# Altium project DIO_MCX_Isolated.PrjPCB (part 1 of 3)
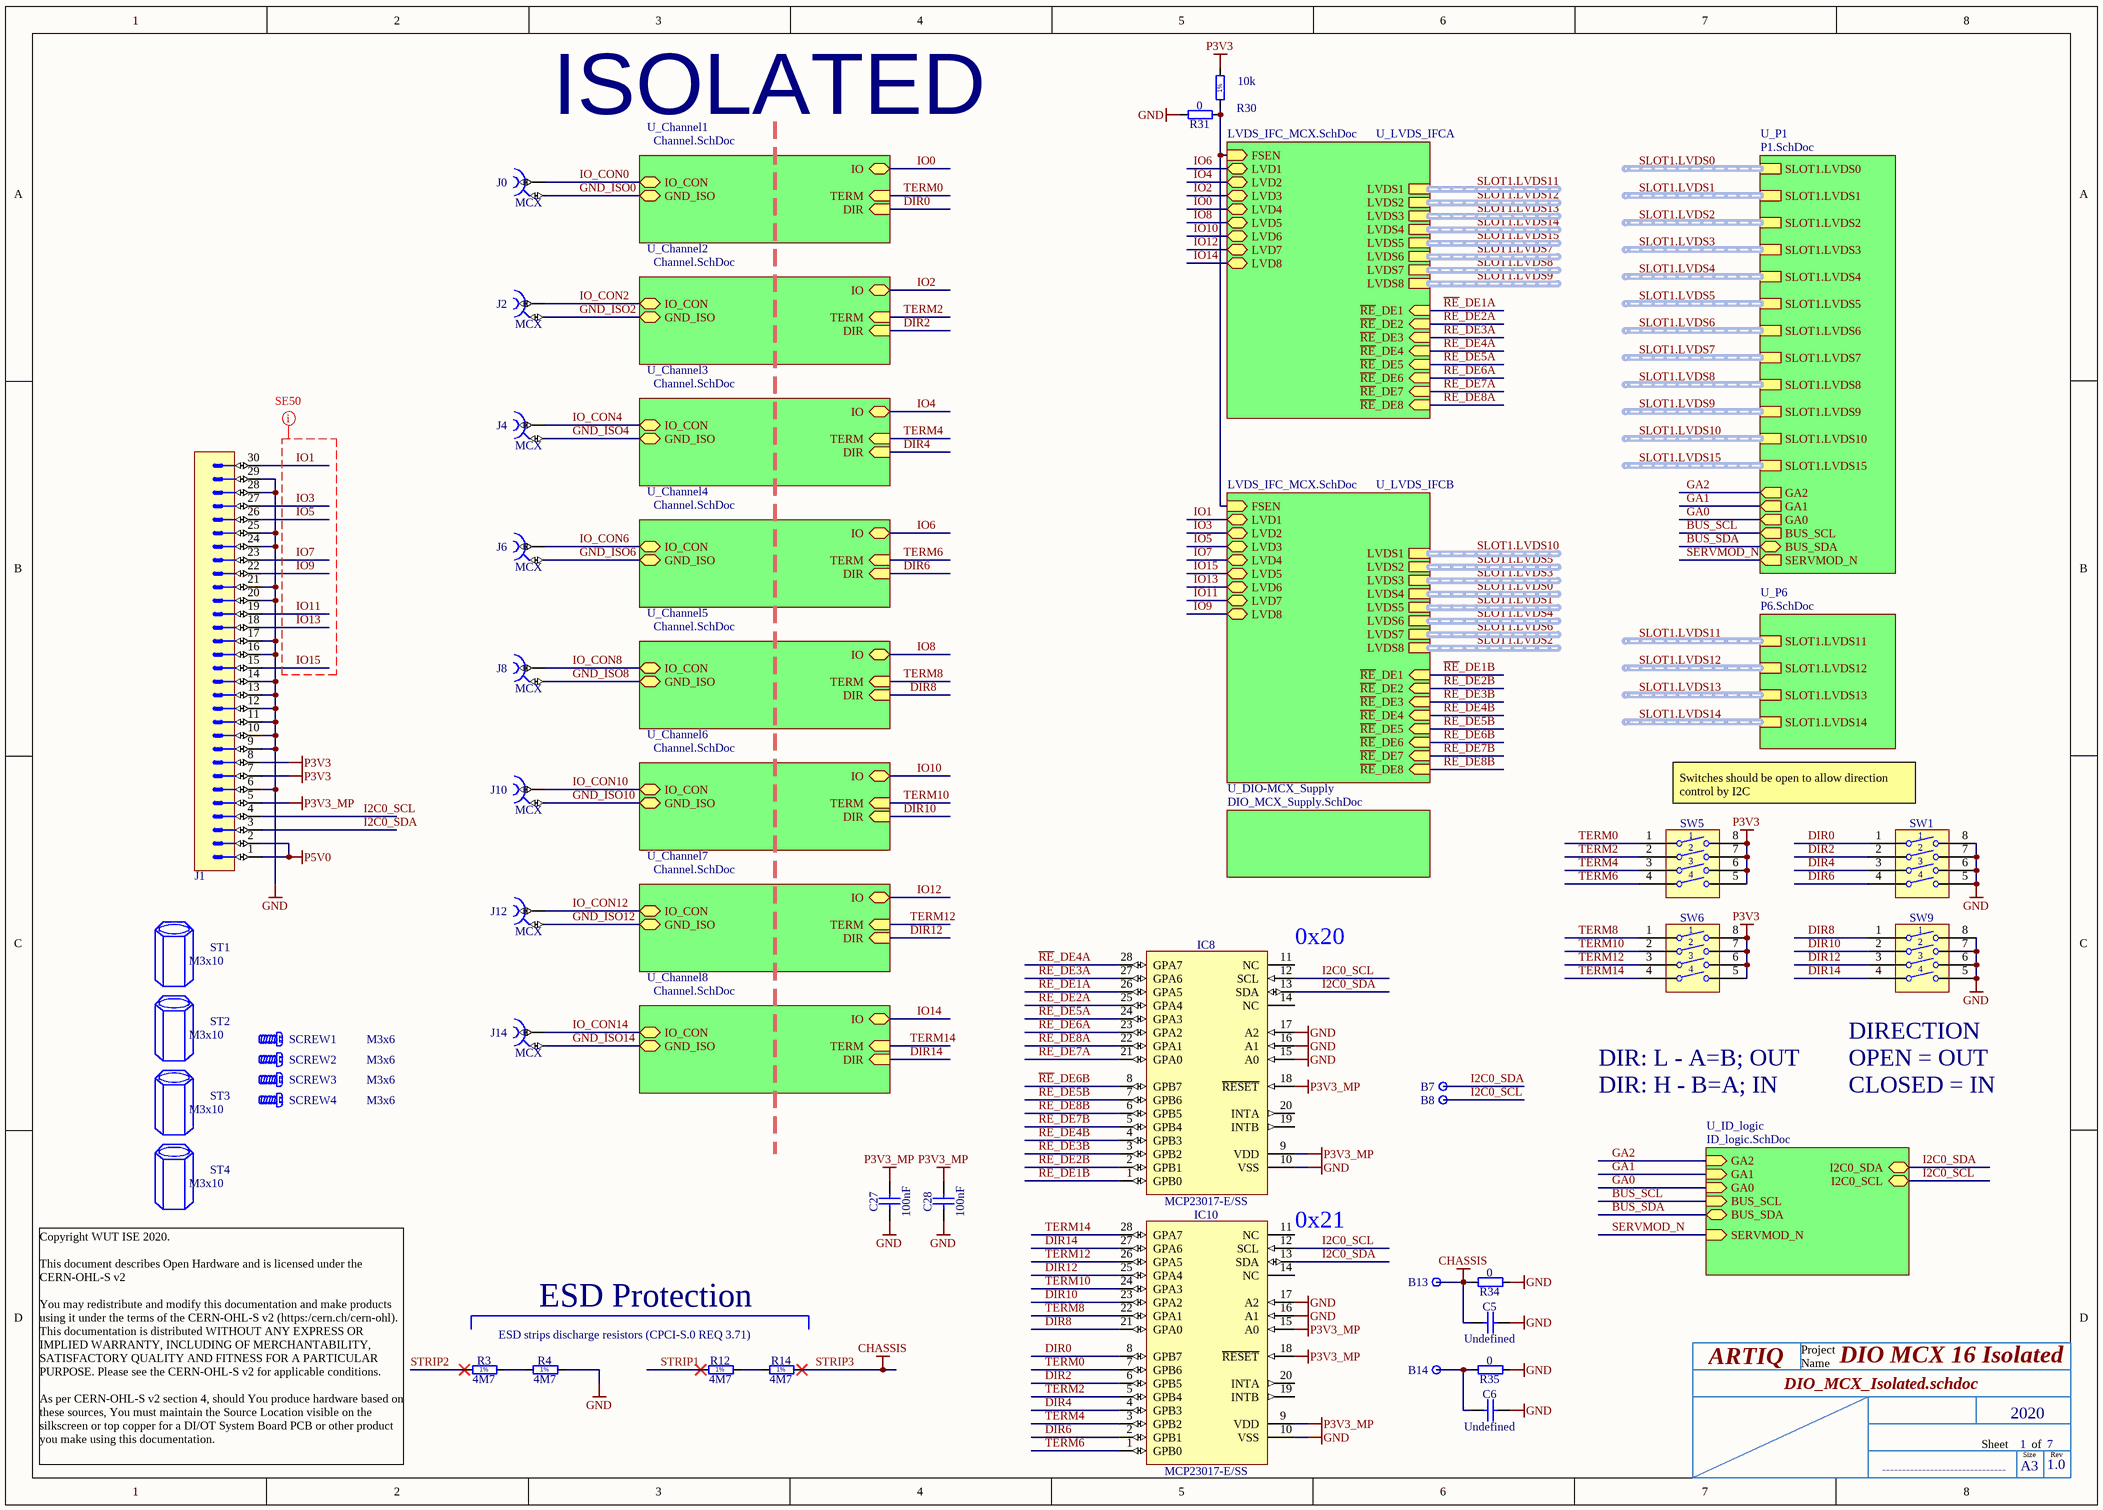
[diagram p0: DIO_MCX_Isolated.schdoc]
7 sheets, 384 parts. Net scope: hierarchical (ports join the sheet entries above them; power ports are global).
Board file: DIO_MCX_Isolated.PCBDOC
Sheets:
  DIO_MCX_Isolated.schdoc
    U_DIO-MCX_Supply = DIO_MCX_Supply.SchDoc
    U_LVDS_IFCA = LVDS_IFC_MCX.SchDoc
    U_LVDS_IFCB = LVDS_IFC_MCX.SchDoc
    U_ID_logic = ID_logic.SchDoc
    U_P1 = P1.SchDoc
    U_P6 = P6.SchDoc
    U_Channel1 = Channel.SchDoc
    U_Channel2 = Channel.SchDoc
    U_Channel3 = Channel.SchDoc
    U_Channel4 = Channel.SchDoc
    U_Channel5 = Channel.SchDoc
    U_Channel6 = Channel.SchDoc
    U_Channel7 = Channel.SchDoc
    U_Channel8 = Channel.SchDoc

## Sheet DIO_MCX_Isolated.schdoc: DIO MCX 16 Isolated
size A3; EDA_Number: ARTIQ; Projet: ARTIQ/SINARA Kasli Subsystem; Author: F.Świtakowski; CompanyName: WUT ISE; DrawnBy: F.Świtakowski; Organization: WUT ISE; Address1: PW ISE; Address2: Nowowiejska 15/19 00-665 Warsaw; DocumentNumber: 1; Revision: 2; SheetNumber: 1; SheetTotal: 7; ModifiedBy: -; CheckedDate: -; Title2: Baseboard Top; DivGrp: WUT ISE; Designer: F.Świtakowski; ModifiedDate: -; ProjectName: Sensor Box

### Parts
B7  Plated Hole  [c130h60]  (value not drawn)
B8  Plated Hole  [c130h60]  (value not drawn)
B13  Plated Hole  [MTG270_500]  (value not drawn)
B14  Plated Hole  [MTG270_500]  (value not drawn)
C5  Undefined  [CAPC2012X135N]
C6  Undefined  [CAPC2012X135N]
C27  100nF  [CAPC1005X55N]
C28  100nF  [CAPC1005X55N]
IC8  MCP23017-E/SS  [SOP65P780X200-28N]
IC10  MCP23017-E/SS  [SOP65P780X200-28N]
J0  MCX  [BEL_133-3701-801]
J1  (no value)  [3M_N2530-6002RB]
J2  MCX  [BEL_133-3701-801]
J4  MCX  [BEL_133-3701-801]
J6  MCX  [BEL_133-3701-801]
J8  MCX  [BEL_133-3701-801]
J10  MCX  [BEL_133-3701-801]
J12  MCX  [BEL_133-3701-801]
J14  MCX  [BEL_133-3701-801]
R3  4M7  [RESC2113X55N]
R4  4M7  [RESC2113X55N]
R12  4M7  [RESC2113X55N]
R14  4M7  [RESC2113X55N]
R30  10k  [RESC1005X40N]
R31  0  [RESC1608X55N]
R34  0  [RESC1608X55N]
R35  0  [RESC1608X55N]
SCREW1  M3x6  [BOSSARD_BN5687-3061605_v]
SCREW2  M3x6  [BOSSARD_BN5687-3061605_v]
SCREW3  M3x6  [BOSSARD_BN5687-3061605_v]
SCREW4  M3x6  [BOSSARD_BN5687-3061605_v]
ST1  M3x10  [HARWIN_R25-1001002]
ST2  M3x10  [HARWIN_R25-1001002]
ST3  M3x10  [HARWIN_R25-1001002]
ST4  M3x10  [HARWIN_R25-1001002]
SW1  Switch  [SW_OMRON_A6S-4102-H]  (value not drawn)
SW5  Switch  [SW_OMRON_A6S-4102-H]  (value not drawn)
SW6  Switch  [SW_OMRON_A6S-4102-H]  (value not drawn)
SW9  Switch  [SW_OMRON_A6S-4102-H]  (value not drawn)

### Sub-sheets
U_Channel1 = Channel.SchDoc: IO (bidir), TERM (in), DIR (in), IO_CON (bidir), GND_ISO (bidir)
U_Channel2 = Channel.SchDoc: IO (bidir), TERM (in), DIR (in), IO_CON (bidir), GND_ISO (bidir)
U_Channel3 = Channel.SchDoc: IO (bidir), TERM (in), DIR (in), IO_CON (bidir), GND_ISO (bidir)
U_Channel4 = Channel.SchDoc: IO (bidir), TERM (in), DIR (in), IO_CON (bidir), GND_ISO (bidir)
U_Channel5 = Channel.SchDoc: IO (bidir), TERM (in), DIR (in), IO_CON (bidir), GND_ISO (bidir)
U_Channel6 = Channel.SchDoc: IO (bidir), TERM (in), DIR (in), IO_CON (bidir), GND_ISO (bidir)
U_Channel7 = Channel.SchDoc: IO (bidir), TERM (in), DIR (in), IO_CON (bidir), GND_ISO (bidir)
U_Channel8 = Channel.SchDoc: IO (bidir), TERM (in), DIR (in), IO_CON (bidir), GND_ISO (bidir)
U_DIO-MCX_Supply = DIO_MCX_Supply.SchDoc: no entries
U_ID_logic = ID_logic.SchDoc: GA2 (in), GA1 (in), GA0 (in), BUS_SCL (in), BUS_SDA (bidir), SERVMOD_N (in), I2C0_SDA (bidir), I2C0_SCL (bidir)
U_LVDS_IFCA = LVDS_IFC_MCX.SchDoc: ~{RE}_DE1 (in), ~{RE}_DE2 (in), ~{RE}_DE3 (in), ~{RE}_DE4 (in), ~{RE}_DE5 (in), ~{RE}_DE6 (in), ~{RE}_DE7 (in), LVD1 (bidir), LVD2 (bidir), LVD5 (bidir), LVD6 (bidir), LVD7 (bidir), LVD3 (bidir), LVD4 (bidir), FSEN (in), LVDS1 (harness LVDS), ~{RE}_DE8 (in), LVDS2 (harness LVDS), LVDS3 (harness LVDS), LVDS4 (harness LVDS), LVDS5 (harness LVDS), LVDS6 (harness LVDS), LVDS7 (harness LVDS), LVDS8 (harness LVDS), LVD8 (bidir)
U_LVDS_IFCB = LVDS_IFC_MCX.SchDoc: LVD1 (bidir), LVD2 (bidir), LVD5 (bidir), LVD6 (bidir), LVD7 (bidir), LVD3 (bidir), LVD4 (bidir), ~{RE}_DE1 (in), ~{RE}_DE2 (in), ~{RE}_DE3 (in), ~{RE}_DE4 (in), ~{RE}_DE5 (in), ~{RE}_DE6 (in), ~{RE}_DE7 (in), FSEN (in), LVDS6 (harness LVDS), LVDS5 (harness LVDS), LVDS4 (harness LVDS), LVDS3 (harness LVDS), LVDS2 (harness LVDS), LVDS1 (harness LVDS), ~{RE}_DE8 (in), LVD8 (bidir), LVDS7 (harness LVDS), LVDS8 (harness LVDS)
U_P1 = P1.SchDoc: SLOT1.LVDS0 (harness LVDS), SLOT1.LVDS1 (harness LVDS), SLOT1.LVDS2 (harness LVDS), SLOT1.LVDS3 (harness LVDS), SLOT1.LVDS4 (harness LVDS), SLOT1.LVDS5 (harness LVDS), SLOT1.LVDS6 (harness LVDS), SLOT1.LVDS7 (harness LVDS), SLOT1.LVDS8 (harness LVDS), SLOT1.LVDS9 (harness LVDS), SLOT1.LVDS10 (harness LVDS), SLOT1.LVDS15 (harness LVDS), GA2 (out), GA1 (out), GA0 (out), BUS_SCL (out), BUS_SDA (bidir), SERVMOD_N (out)
U_P6 = P6.SchDoc: SLOT1.LVDS11 (harness LVDS), SLOT1.LVDS12 (harness LVDS), SLOT1.LVDS13 (harness LVDS), SLOT1.LVDS14 (harness LVDS)

### Nets
GND: C5.2 C6.2 C27.1 C28.1 IC8.10(VSS) IC8.15(A0) IC8.16(A1) IC8.17(A2) IC10.10(VSS) IC10.16(A1) IC10.17(A2) J1.6 J1.9 J1.10 J1.11 J1.12 J1.13 J1.14 J1.16 J1.17 J1.20 J1.21 J1.24 J1.25 J1.28 J1.29 R4.2 R31.2 R34.1 R35.1 SW1.5 SW1.6 SW1.7 SW1.8 SW9.5 SW9.6 SW9.7 SW9.8
P3V3: J1.7 J1.8 R30.2 SW5.5 SW5.6 SW5.7 SW5.8 SW6.5 SW6.6 SW6.7 SW6.8
P3V3_MP: C27.2 C28.2 IC8.9(VDD) IC8.18(~{RESET}) IC10.9(VDD) IC10.15(A0) IC10.18(~{RESET}) J1.5
P5V0: J1.1 J1.2
STRIP3: B13.1 C5.1 R14.2 R34.2  [also labelled CHASSIS]
BUS_SCL: sheet U_ID_logic/BUS_SCL, sheet U_P1/BUS_SCL
BUS_SDA: sheet U_ID_logic/BUS_SDA, sheet U_P1/BUS_SDA
DIR0: IC10.8(GPB7) SW1.1 ; sheet U_Channel1/DIR  [project net DIR]
DIR2: IC10.6(GPB5) SW1.2 ; sheet U_Channel2/DIR  [project net DIR]
DIR4: IC10.4(GPB3) SW1.3 ; sheet U_Channel3/DIR  [project net DIR]
DIR6: IC10.2(GPB1) SW1.4 ; sheet U_Channel4/DIR  [project net DIR]
DIR8: IC10.21(GPA0) SW9.1 ; sheet U_Channel5/DIR  [project net DIR]
DIR10: IC10.23(GPA2) SW9.2 ; sheet U_Channel6/DIR  [project net DIR]
DIR12: IC10.25(GPA4) SW9.3 ; sheet U_Channel7/DIR  [project net DIR]
DIR14: IC10.27(GPA6) SW9.4 ; sheet U_Channel8/DIR  [project net DIR]
GA0: sheet U_ID_logic/GA0, sheet U_P1/GA0
GA1: sheet U_ID_logic/GA1, sheet U_P1/GA1
GA2: sheet U_ID_logic/GA2, sheet U_P1/GA2
GND_ISO0: J0.2 ; sheet U_Channel1/GND_ISO  [project net GND_ISO]
GND_ISO2: J2.2 ; sheet U_Channel2/GND_ISO  [project net GND_ISO]
GND_ISO4: J4.2 ; sheet U_Channel3/GND_ISO  [project net GND_ISO]
GND_ISO6: J6.2 ; sheet U_Channel4/GND_ISO  [project net GND_ISO]
GND_ISO8: J8.2 ; sheet U_Channel5/GND_ISO  [project net GND_ISO]
GND_ISO10: J10.2 ; sheet U_Channel6/GND_ISO  [project net GND_ISO]
GND_ISO12: J12.2 ; sheet U_Channel7/GND_ISO  [project net GND_ISO]
GND_ISO14: J14.2 ; sheet U_Channel8/GND_ISO  [project net GND_ISO]
I2C0_SCL: B8.1 IC8.12(SCL) IC10.12(SCL) J1.4 ; sheet U_ID_logic/I2C0_SCL
I2C0_SDA: B7.1 IC8.13(SDA) IC10.13(SDA) J1.3 ; sheet U_ID_logic/I2C0_SDA
IO0: sheet U_LVDS_IFCA/LVD4, sheet U_Channel1/IO  [project net IO]
IO1: J1.30 ; sheet U_LVDS_IFCB/LVD1
IO2: sheet U_LVDS_IFCA/LVD3, sheet U_Channel2/IO  [project net IO]
IO3: J1.27 ; sheet U_LVDS_IFCB/LVD2
IO4: sheet U_LVDS_IFCA/LVD2, sheet U_Channel3/IO  [project net IO]
IO5: J1.26 ; sheet U_LVDS_IFCB/LVD3
IO6: sheet U_LVDS_IFCA/LVD1, sheet U_Channel4/IO  [project net IO]
IO7: J1.23 ; sheet U_LVDS_IFCB/LVD4
IO8: sheet U_LVDS_IFCA/LVD5, sheet U_Channel5/IO  [project net IO]
IO9: J1.22 ; sheet U_LVDS_IFCB/LVD8
IO10: sheet U_LVDS_IFCA/LVD6, sheet U_Channel6/IO  [project net IO]
IO11: J1.19 ; sheet U_LVDS_IFCB/LVD7
IO12: sheet U_LVDS_IFCA/LVD7, sheet U_Channel7/IO  [project net IO]
IO13: J1.18 ; sheet U_LVDS_IFCB/LVD6
IO14: sheet U_LVDS_IFCA/LVD8, sheet U_Channel8/IO  [project net IO]
IO15: J1.15 ; sheet U_LVDS_IFCB/LVD5
IO_CON0: J0.1 ; sheet U_Channel1/IO_CON  [project net IO_CON]
IO_CON2: J2.1 ; sheet U_Channel2/IO_CON  [project net IO_CON]
IO_CON4: J4.1 ; sheet U_Channel3/IO_CON  [project net IO_CON]
IO_CON6: J6.1 ; sheet U_Channel4/IO_CON  [project net IO_CON]
IO_CON8: J8.1 ; sheet U_Channel5/IO_CON  [project net IO_CON]
IO_CON10: J10.1 ; sheet U_Channel6/IO_CON  [project net IO_CON]
IO_CON12: J12.1 ; sheet U_Channel7/IO_CON  [project net IO_CON]
IO_CON14: J14.1 ; sheet U_Channel8/IO_CON  [project net IO_CON]
~{RE}_DE1A: IC8.26(GPA5) ; sheet U_LVDS_IFCA/~{RE}_DE1
~{RE}_DE1B: IC8.1(GPB0) ; sheet U_LVDS_IFCB/~{RE}_DE1
~{RE}_DE2A: IC8.25(GPA4) ; sheet U_LVDS_IFCA/~{RE}_DE2
~{RE}_DE2B: IC8.2(GPB1) ; sheet U_LVDS_IFCB/~{RE}_DE2
~{RE}_DE3A: IC8.27(GPA6) ; sheet U_LVDS_IFCA/~{RE}_DE3
~{RE}_DE3B: IC8.3(GPB2) ; sheet U_LVDS_IFCB/~{RE}_DE3
~{RE}_DE4A: IC8.28(GPA7) ; sheet U_LVDS_IFCA/~{RE}_DE4
~{RE}_DE4B: IC8.4(GPB3) ; sheet U_LVDS_IFCB/~{RE}_DE4
~{RE}_DE5A: IC8.24(GPA3) ; sheet U_LVDS_IFCA/~{RE}_DE5
~{RE}_DE5B: IC8.7(GPB6) ; sheet U_LVDS_IFCB/~{RE}_DE5
~{RE}_DE6A: IC8.23(GPA2) ; sheet U_LVDS_IFCA/~{RE}_DE6
~{RE}_DE6B: IC8.8(GPB7) ; sheet U_LVDS_IFCB/~{RE}_DE6
~{RE}_DE7A: IC8.21(GPA0) ; sheet U_LVDS_IFCA/~{RE}_DE7
~{RE}_DE7B: IC8.5(GPB4) ; sheet U_LVDS_IFCB/~{RE}_DE7
~{RE}_DE8A: IC8.22(GPA1) ; sheet U_LVDS_IFCA/~{RE}_DE8
~{RE}_DE8B: IC8.6(GPB5) ; sheet U_LVDS_IFCB/~{RE}_DE8
SERVMOD_N: sheet U_ID_logic/SERVMOD_N, sheet U_P1/SERVMOD_N
STRIP1: R12.1
STRIP2: R3.1
TERM0: IC10.7(GPB6) SW5.1 ; sheet U_Channel1/TERM  [project net TERM]
TERM2: IC10.5(GPB4) SW5.2 ; sheet U_Channel2/TERM  [project net TERM]
TERM4: IC10.3(GPB2) SW5.3 ; sheet U_Channel3/TERM  [project net TERM]
TERM6: IC10.1(GPB0) SW5.4 ; sheet U_Channel4/TERM  [project net TERM]
TERM8: IC10.22(GPA1) SW6.1 ; sheet U_Channel5/TERM  [project net TERM]
TERM10: IC10.24(GPA3) SW6.2 ; sheet U_Channel6/TERM  [project net TERM]
TERM12: IC10.26(GPA5) SW6.3 ; sheet U_Channel7/TERM  [project net TERM]
TERM14: IC10.28(GPA7) SW6.4 ; sheet U_Channel8/TERM  [project net TERM]
NetB14_1: B14.1 C6.1 R35.2
NetIC1A_20: R30.1 R31.1 ; sheet U_LVDS_IFCA/FSEN, sheet U_LVDS_IFCB/FSEN
NetR3_2: R3.2 R4.1
NetR12_2: R12.2 R14.1

Not connected (* = marked no-connect by the designer): IC8 11(NC) 14(NC) 19(INTB) 20(INTA); IC10 11(NC) 14(NC) 19(INTB) 20(INTA)

### Buses and harness runs
harness SLOT1.LVDS0 = sheet U_LVDS_IFCB/LVDS4
harness SLOT1.LVDS0 = sheet U_P1/SLOT1.LVDS0
harness SLOT1.LVDS1 = sheet U_LVDS_IFCB/LVDS5
harness SLOT1.LVDS1 = sheet U_P1/SLOT1.LVDS1
harness SLOT1.LVDS2 = sheet U_LVDS_IFCB/LVDS8
harness SLOT1.LVDS2 = sheet U_P1/SLOT1.LVDS2
harness SLOT1.LVDS3 = sheet U_LVDS_IFCB/LVDS3
harness SLOT1.LVDS3 = sheet U_P1/SLOT1.LVDS3
harness SLOT1.LVDS4 = sheet U_LVDS_IFCB/LVDS6
harness SLOT1.LVDS4 = sheet U_P1/SLOT1.LVDS4
harness SLOT1.LVDS5 = sheet U_LVDS_IFCB/LVDS2
harness SLOT1.LVDS5 = sheet U_P1/SLOT1.LVDS5
harness SLOT1.LVDS6 = sheet U_LVDS_IFCB/LVDS7
harness SLOT1.LVDS6 = sheet U_P1/SLOT1.LVDS6
harness SLOT1.LVDS7 = sheet U_LVDS_IFCA/LVDS6
harness SLOT1.LVDS7 = sheet U_P1/SLOT1.LVDS7
harness SLOT1.LVDS8 = sheet U_LVDS_IFCA/LVDS7
harness SLOT1.LVDS8 = sheet U_P1/SLOT1.LVDS8
harness SLOT1.LVDS9 = sheet U_LVDS_IFCA/LVDS8
harness SLOT1.LVDS9 = sheet U_P1/SLOT1.LVDS9
harness SLOT1.LVDS10 = sheet U_LVDS_IFCB/LVDS1
harness SLOT1.LVDS10 = sheet U_P1/SLOT1.LVDS10
harness SLOT1.LVDS11 = sheet U_LVDS_IFCA/LVDS1
harness SLOT1.LVDS11 = sheet U_P6/SLOT1.LVDS11
harness SLOT1.LVDS12 = sheet U_LVDS_IFCA/LVDS2
harness SLOT1.LVDS12 = sheet U_P6/SLOT1.LVDS12
harness SLOT1.LVDS13 = sheet U_LVDS_IFCA/LVDS3
harness SLOT1.LVDS13 = sheet U_P6/SLOT1.LVDS13
harness SLOT1.LVDS14 = sheet U_LVDS_IFCA/LVDS4
harness SLOT1.LVDS14 = sheet U_P6/SLOT1.LVDS14
harness SLOT1.LVDS15 = sheet U_LVDS_IFCA/LVDS5
harness SLOT1.LVDS15 = sheet U_P1/SLOT1.LVDS15

### Layout directives
net class SE50; rule Width Constraint [Pref Width = 0.35mm    Min Width = 0.3mm    Max Width = 0.35mm]: IO1, IO3, IO5, IO7, IO9, IO11, IO13, IO15

### Notes on the sheet
- (near J0) ISOLATED
- Switches should be open to allow direction control by I2C
- (near IC8) 0x20
- (near SW9) DIRECTION
- DIR: L - A=B; OUT
- DIR: H - B=A; IN
- OPEN = OUT
- CLOSED = IN
- 0x21
- ESD Protection
- ESD strips discharge resistors (CPCI-S.0 REQ 3.71)
- ARTIQ
- Project
- Name
- Copyright WUT ISE 2020.
  This document describes Open Hardware and is licensed under the CERN-OHL-S v2
  You may redistribute and modify this documentation and make products using it under the terms of the CERN-OHL-S v2 (https:/cern.ch/cern-ohl). This documentation is distributed WITHOUT ANY EXPRESS OR IMPLIED WARRANTY, INCLUDING OF MERCHANTABILITY, SATISFACTORY QUALITY AND FITNESS FOR A PARTICULAR PURPOSE. Please see the CERN-OHL-S v2 for applicable conditions.
  As per CERN-OHL-S v2 section 4, should You produce hardware based on these sources, You must maintain the Source Location visible on the silkscreen or top copper for a DI/OT System Board PCB or other product you make using this documentation.
- Sheet
- 2020
- Size
- A3
- of
- Rev
- -------------------------------
- 1.0
- (in symbol R0402_10K_1%_0.0625W_100PPM) 1%
- (in symbol R0805_4M7_1%_0.125W_100PPM_VISHAY_CRCW e3) 1%

### Library data of the parts
B7 B8 = PLATED_HOLE0.6_PAD1.3: Single Terminal Socket; Part Description: Plated Through Hole: Hole Dia.=0.6mm Pad Dia.=1.3mm; Mounted: No; Part Number: PLATED_HOLE0.6_PAD1.3; Component Kind: Standard (No BOM); Component Type: Standard (No BOM); Pin Count: 1; Family: Plated Hole; Socket: No; SMD: No; Sense: No; Status: None; ComponentHeight: 0mm; HelpURL: Undefined; Author: CERN DEM MR; CreateDate: 02.03.2016; LatestRevisionDate: 02.03.2016; PackageDescription: Plated Through Hole: Hole Dia.=0.6mm Pad Dia.=1.3mm
B13 B14 = PLATED_HOLE2.7_PAD5.0: Single Terminal Socket; Part Description: Plated Through Hole: Hole Dia.=2.7mm Pad Dia.=5.0mm; Mounted: No; Part Number: PLATED_HOLE2.7_PAD5.0; Component Kind: Standard (No BOM); Component Type: Standard (No BOM); Pin Count: 1; Family: Plated Hole; Socket: No; SMD: No; Sense: No; Status: None; ComponentHeight: 0mm; HelpURL: Undefined; Author: CERN DEM JMW; CreateDate: 27.09.2011; LatestRevisionDate: 27.09.2011; PackageDescription: Plated Through Hole: Hole Dia.=2.7mm Pad Dia.=5.0mm
C5 C6 = CC0805_NO-VALUE: Non-polarised capacitor; Part Description: Reserved Footprint For 0805(2012) Chip Ceramic Capacitor; Mounted: No; Part Number: CC0805_NO-VALUE; Component Kind: Standard; Component Type: Standard; Pin Count: 2; Value: Undefined; Status: None; Manufacturer: Undefined; Manufacturer Part Number: CC0805_NO-VALUE; Case: 0805; Socket: No; SMD: Yes; Sense: No; Manufacturer1 ComponentHeight: 1.35mm; HelpURL: Undefined; Author: CERN DEM JLC; CreateDate: 10.12.2008; LatestRevisionDate: 11.09.2013
C27 C28 = CC0402_100NF_50V_10%_X7R: Non-polarised capacitor; Part Description: SMD Multilayer Chip Ceramic Capacitor; Manufacturer: GENERIC; Manufacturer1 Part Number: GRM155R71H104KE14D; Voltage: 50V; TC: X7R; Tolerance: ±10%; Part Number: CC0402_100NF_50V_10%_X7R; Component Kind: Standard; Component Type: Standard; Pin Count: 2; Value: 100nF; Status: None; Manufacturer Part Number: CC0402_100NF_50V_10%_X7R; Case: 0402; Mounted: Yes; Socket: No; SMD: Yes; Sense: No; Manufacturer1 Example: MURATA; Manufacturer1 ComponentHeight: 0.55mm; HelpURL: \\cern.ch\dfs\Applications\Altium\Datasheets\CC0402_MURATA_GRM155R71H104KE14D.pdf; Author: CERN DEM MR; CreateDate: 30.06.2017; LatestRevisionDate: 30.06.2017
IC8 IC10 = MCP23017-E/SS: 16-bit I/O Port Expander With Serial Interface; Manufacturer: MICROCHIP TECHNOLOGY; PressFit: No; Bonding: No; Part Number: MCP23017-E/SS; Component Kind: Standard; Component Type: Standard; Device: MCP23017-E/SS; PackageDescription: SOP, 0.65mm Pitch; 28 pin, 5.30mm W X 10.20mm L X 2.00mm H body, IPC Medium Density; Part Description: 16-bit I/O Port Expander With Serial Interface; Manufacturer Part Number: MCP23017-E/SS; Pin Count: 28; Case: SSOP28; Mounted: Yes; Socket: No; SMD: Yes; Sense: No; ComponentHeight: 2mm; Author: CERN DEM JLC; HelpURL: \\cern.ch\dfs\Applications\Altium\Datasheets\MCP23017-E-SS.pdf; CreateDate: 17/01/2011; LatestRevisionDate: 17/01/2011
J0 J2 J4 J6 J8 J10 J12 J14 = BELFUSE_133-3701-801: Part Description: MCX Jack, End Launch Straight Receptacle - Tab Contact, For 1.6mm Thickness Board; Manufacturer: BEL; PressFit: No; Part Number: BELFUSE_133-3701-801; Component Kind: Standard; Component Type: Standard; Pin Count: 2; Family: MCX; Mounted: Yes; Socket: No; SMD: No; Sense: No; Status: None; Manufacturer Part Number: 133-3701-801; ComponentHeight: 3.53mm; HelpURL: \\cern.ch\dfs\Applications\Altium\Datasheets\BEL_133-3701-801.pdf; Author: CERN DEM MR; CreateDate: 21.10.2019; LatestRevisionDate: 21.10.2019
J1 = 3M_N2530-6002RB: Connector 30 Male; Part Description: 30 Contacts - Straight .100'' x .100'' Low Profile Four-Wall Header, 2500 Series; Manufacturer: 3M; PressFit: No; Part Number: 3M_N2530-6002RB; Component Kind: Standard; Component Type: Standard; Pin Count: 30; Family: Header 30; Mounted: Yes; Socket: No; SMD: No; Sense: No; Status: None; Manufacturer Part Number: N2530-6002RB; ComponentHeight: 10.03mm; HelpURL: \\cern.ch\dfs\Applications\Altium\Datasheets\3M_N2530-6002RB.pdf; Author: CERN DEM JLC; CreateDate: 11.02.2009; LatestRevisionDate: 11.08.2009
R3 R4 R12 R14 = R0805_4M7_1%_0.125W_100PPM_VISHAY_CRCW e3: Resistor - 1%; Part Description: 150V, Standard Thick Film Chip Resistor; Manufacturer: VISHAY; Manufacturer Part Number: CRCW08054M70FKEA; Power: 0.125W; TC: ±100ppm/°C; PressFit: No; Part Number: R0805_4M7_1%_0.125W_100PPM_VISHAY_CRCW e3; Component Kind: Standard; Component Type: Standard; Pin Count: 2; Value: 4M7; Status: None; Tolerance: ±1%; Case: 0805; Mounted: Yes; Sense: No; Socket: No; SMD: Yes; ComponentHeight: 0.5mm; HelpURL: \\cern.ch\dfs\Applications\Altium\Datasheets\R0805_VISHAY_CRCW e3.pdf; Author: CERN DEM BR; CreateDate: 27/05/2019; LatestRevisionDate: 27/05/2019
R30 = R0402_10K_1%_0.0625W_100PPM: Resistor - 1%; Part Description: General Purpose Thick Film Chip Resistor; Manufacturer: GENERIC; Manufacturer1 Part Number: 232270671003L; TC: ±100ppm/°C; Part Number: R0402_10K_1%_0.0625W_100PPM; Component Kind: Standard; Component Type: Standard; Pin Count: 2; Value: 10k; Status: Not recommended; Power: 0.0625W; Tolerance: ±1%; Manufacturer Part Number: R0402_10K_1%_0.0625W_100PPM; Case: 0402; Mounted: Yes; Sense: No; Socket: No; SMD: Yes; Manufacturer1 Example: YAGEO PHYCOMP; Manufacturer1 ComponentHeight: 0.4mm; HelpURL: \\cern.ch\dfs\Applications\Altium\Datasheets\R0402_Phycomp_RC0402.pdf; Author: CERN DEM JLC; CreateDate: 03.12.2007; LatestRevisionDate: 17.10.2012
R31 R34 R35 = R0603_0R_JUMPER: Resistor; Part Description: 1A (0.05R Max DC Resistance) Zero Ohm Jumper; Manufacturer: GENERIC; Manufacturer1 Part Number: NRC06Z0; PressFit: No; Part Number: R0603_0R_JUMPER; Component Kind: Standard; Component Type: Standard; Pin Count: 2; Value: 0; Status: Preferred; Manufacturer Part Number: R0603_0R_JUMPER; Case: 0603; Mounted: Yes; Sense: No; Socket: No; SMD: Yes; Manufacturer1 Example: NIC COMPONENT; Manufacturer1 ComponentHeight: 0.55mm; HelpURL: \\cern.ch\dfs\Applications\Altium\Datasheets\R0603_NIC_NRC.pdf; Author: CERN DEM JLC; CreateDate: 03.12.2007; LatestRevisionDate: 13.03.2008
SCREW1-SCREW4 = BOSSARD_BN5687-3061605_v: Screw; Part Description: M3 L=6mm Hexalobular Socket Pan Head Screw, Fully Threaded, Stainless Steel A2; Manufacturer Part Number: BN5687 Art.3061605; PressFit: No; Part Number: BOSSARD_BN5687-3061605_v; Component Kind: Standard; Component Type: Mechanical; Pin Count: 0; PackageDescription: M3 L=6mm Hexalobular Socket Pan Head Screw, Fully Threaded - Stainless Steel A2; Mounted: Yes; Socket: No; SMD: No; Sense: No; Status: None; Value: M3x6; Manufacturer: BOSSARD; ComponentHeight: 2.4mm; HelpURL: \\cern.ch\dfs\Applications\Altium\Datasheets\BOSSARD_BN5687-3061605.pdf; Author: CERN DEM JLC; CreateDate: 15.01.2013; LatestRevisionDate: 15.01.2013
ST1-ST4 = MECH_Standoff_M3x10: M3x10 standoff; Part Number: DREMEC_TFF-M3X10/DR124; Part Description: M3x10 female Hex Spacer made of free-machining brass with nickel plated finish; Manufacturer: DREMEC; Manufacturer Part Number: TFF-M3X10/DR124; PressFit: No; Component Kind: Standard; Component Type: Mechanical; Footprint: DREMEC_TFF-M3X10/DR124; Pin Count: 0; PackageDescription: M3 L=10mm   Fully Threaded - Stainless Steel spacer; Mounted: Yes; Socket: No; SMD: No; Sense: No; Status: None; Value: M3x10; ComponentHeight: 10mm; HelpURL: \\cern.ch\dfs\Applications\Altium\Datasheets\BOSSARD_BN5687-3061597.pdf; Author: GK; CreateDate: 25.02.2019; LatestRevisionDate: 25.02.2019
SW1 SW5 SW6 SW9 = SW_OMRON_A6S-4102-H: 4 Ways SPST DIP Switch; Part Description: 4 Ways SPST DIP Switch, White Flat Actuator with Seal Tape, Contact Rating 25mA 24VDC; Manufacturer: OMRON; PressFit: No; Part Number: SW_OMRON_A6S-4102-H; Component Kind: Standard; Component Type: Standard; Pin Count: 8; PackageDescription: Pitch 2.54mm, Body 11.3x6.4mm, 4 Ways SPST Surface-Mounting DIP Switch, OMRON A6S-H; Family: Switch; Mounted: Yes; Socket: No; SMD: Yes; Sense: No; Status: None; Manufacturer Part Number: A6S-4102-H; ComponentHeight: 3.8mm; HelpURL: \\cern.ch\dfs\Applications\Altium\Datasheets\SW_OMRON_A6S-4102-H.pdf; Author: CERN DEM JMW; CreateDate: 25.09.2008; LatestRevisionDate: 25.09.2008

## Sheet DIO_MCX_Supply.SchDoc: DIO MCX 16 Isolated
size A4; EDA_Number: ARTIQ; Projet: ARTIQ/SINARA Kasli Subsystem; CompanyName: WUT ISE; Organization: WUT ISE; Address1: PW ISE; Address2: Nowowiejska 15/19 00-665 Warsaw; DocumentNumber: 3; Revision: 2; SheetNumber: 3; SheetTotal: 7; ModifiedBy: -; CheckedDate: -; Title2: Power supply; DivGrp: WUT ISE; ModifiedDate: -; ProjectName: Sensor Box
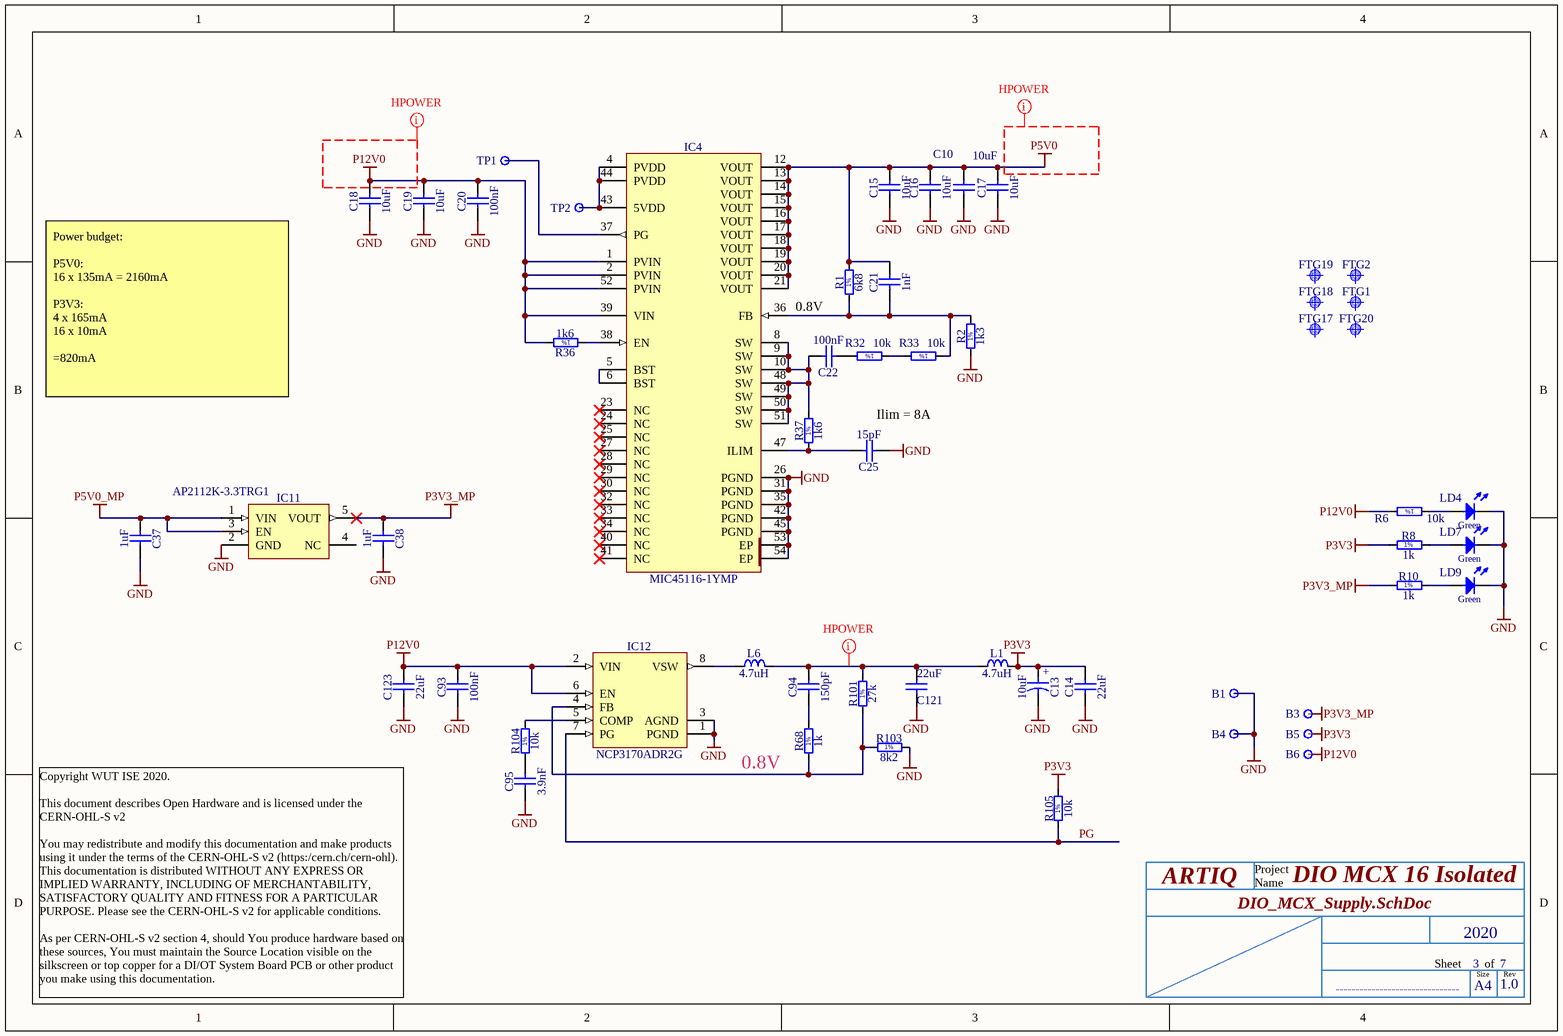
[diagram p1: DIO_MCX_Supply.SchDoc]

### Parts
B1  Plated Hole  [c130h60]  (value not drawn)
B3  Plated Hole  [c130h60]  (value not drawn)
B4  Plated Hole  [c130h60]  (value not drawn)
B5  Plated Hole  [c130h60]  (value not drawn)
B6  Plated Hole  [c130h60]  (value not drawn)
C10  10uF  [CAPC2012X135N]
C13  10uF  [CAPAE430X540N]
C14  22uF  [CAPC2012X135N]
C15  10uF  [CAPC2012X135N]
C16  10uF  [CAPC2012X135N]
C17  10uF  [CAPC2012X135N]
C18  10uF  [CAPC2012X135N]
C19  10uF  [CAPC2012X135N]
C20  100nF  [CAPC1005X55N]
C21  1nF  [CAPC1608X87N]
C22  100nF  [CAPC1005X55N]
C25  15pF  [CAPC1005X55N]
C37  1uF  [CAPC1005X55N]
C38  1uF  [CAPC1005X55N]
C93  100nF  [CAPC1005X55N]
C94  150pF  [CAPC1608X87N]
C95  3.9nF  [CAPC1608X87N]
C121  22uF  [CAPC2012X135N]
C123  22uF  [CAPC2012X135N]
FTG1  Use only in PCB  [FIDUCIAL_TOP_C100-200]  (value not drawn)
FTG2  Use only in PCB  [FIDUCIAL_TOP_C100-200]  (value not drawn)
FTG17  Use only in PCB  [FIDUCIAL_TOP_C100-200]  (value not drawn)
FTG18  Use only in PCB  [FIDUCIAL_TOP_S100-200]  (value not drawn)
FTG19  Use only in PCB  [FIDUCIAL_TOP_S100-200]  (value not drawn)
FTG20  Use only in PCB  [FIDUCIAL_TOP_S100-200]  (value not drawn)
IC4  MIC45116-1YMP  [MICROCHIP_H3QFN88-52LD-PL-3]
IC11  AP2112K-3.3TRG1  [SOT95P285X140-5N]
IC12  NCP3170ADR2G  [SOIC127P600X175-8N]
L1  4.7uH  [IND_BOURNS_SRU8043]
L6  4.7uH  [IND_BOURNS_SRU8043]
LD4  Green  [LED_KINGBRIGHT_KPH-1608CGCK]  (value not drawn)
LD7  Green  [LED_KINGBRIGHT_KPH-1608CGCK]  (value not drawn)
LD9  Green  [LED_KINGBRIGHT_KPH-1608CGCK]  (value not drawn)
R1  6k8  [RESC1005X40N]
R2  1k3  [RESC1608X55N]
R6  10k  [RESC1005X40N]
R8  1k  [RESC1005X40N]
R10  1k  [RESC1005X40N]
R32  10k  [RESC1005X40N]
R33  10k  [RESC1005X40N]
R36  1k6  [RESC1005X40N]
R37  1k6  [RESC1005X40N]
R68  1k  [RESC1005X40N]
R101  27k  [RESC1005X40N]
R103  8k2  [RESC1005X40N]
R104  10k  [RESC1005X40N]
R105  10k  [RESC1005X40N]
TP1  Test Point  [TPS127]  (value not drawn)
TP2  Test Point  [TPS127]  (value not drawn)

### Nets
GND: B1.1 B4.1 C10.1 C13.2 C14.1 C15.1 C16.1 C17.1 C18.1 C19.1 C20.1 C25.1 C37.1 C38.1 C93.1 C95.1 C121.1 C123.1 IC4.26(PGND) IC4.31(PGND) IC4.35(PGND) IC4.42(PGND) IC4.45(PGND) IC4.53(EP) IC4.54(EP) IC11.2(GND) IC12.1(PGND) IC12.3(AGND) LD4.1(C) LD7.1(C) LD9.1(C) R2.1 R103.2
P3V3: B5.1 C13.1 C14.2 L1.2 R8.1 R105.2
P3V3_MP: B3.1 C38.2 IC11.5(VOUT) R10.1
P5V0: C10.2 C15.2 C16.2 C17.2 C21.2 IC4.12(VOUT) IC4.13(VOUT) IC4.14(VOUT) IC4.15(VOUT) IC4.16(VOUT) IC4.17(VOUT) IC4.18(VOUT) IC4.19(VOUT) IC4.20(VOUT) IC4.21(VOUT) R1.2
P5V0_MP: C37.2 IC11.1(VIN) IC11.3(EN)
P12V0: B6.1 C18.2 C19.2 C20.2 C93.2 C123.2 IC4.1(PVIN) IC4.2(PVIN) IC4.39(VIN) IC4.52(PVIN) IC12.2(VIN) IC12.6(EN) R6.2 R36.2
PG: IC12.7(PG) R105.1
NetC21_1: C21.1 IC4.36(FB) R1.1 R2.2 R33.1
NetC22_1: C22.1 R32.2
NetC22_2: C22.2 IC4.8(SW) IC4.9(SW) IC4.10(SW) IC4.48(SW) IC4.49(SW) IC4.50(SW) IC4.51(SW) R37.2
NetC25_2: C25.2 IC4.47(ILIM) R37.1
NetC94_1: C94.1 R68.2
NetC94_2: C94.2 C121.2 L1.1 L6.2 R101.2
NetC95_2: C95.2 R104.1
NetIC4_4: IC4.4(PVDD) IC4.43(5VDD) IC4.44(PVDD) TP2.1
NetIC4_5: IC4.5(BST) IC4.6(BST)
NetIC4_37: IC4.37(PG) TP1.1
NetIC4_38: IC4.38(EN) R36.1
NetIC12_4: IC12.4(FB) R68.1 R101.1 R103.1
NetIC12_5: IC12.5(COMP) R104.2
NetIC12_8: IC12.8(VSW) L6.1
NetLD4_2: LD4.2(A) R6.1
NetLD7_2: LD7.2(A) R8.2
NetLD9_2: LD9.2(A) R10.2
NetR32_1: R32.1 R33.2

Not connected (* = marked no-connect by the designer): IC4 23(NC)* 24(NC)* 25(NC)* 27(NC)* 28(NC)* 29(NC)* 30(NC)* 32(NC)* 33(NC)* 34(NC)* 40(NC)* 41(NC)*; IC11 4(NC)

### Layout directives
net class Hpower; rule Routing Via Style [Pref Size = 0.7mm    Pref Hole Size = 0.5mm]; rule Width Constraint [Pref Width = 20mil    Min Width = 15mil    Max Width = 50mil]: NetC94_2, P12V0
net class Hpower; rule Routing Via Style [Pref Size = 0.7mm    Pref Hole Size = 0.5mm]; rule Width Constraint [Pref Width = 0.508mm    Min Width = 0.15mm    Max Width = 1.27mm]: P5V0

### Notes on the sheet
- 0.8V
- Power budget:
  P5V0:
  16 x 135mA = 2160mA
  P3V3:
  4 x 165mA
  16 x 10mA
  =820mA
- (near C25) Ilim = 8A
- (near R68) 0.8V
- ARTIQ
- Project
- Name
- Sheet
- 2020
- Size
- A4
- of
- 1.0
- Rev
- Copyright WUT ISE 2020.
  This document describes Open Hardware and is licensed under the CERN-OHL-S v2
  You may redistribute and modify this documentation and make products using it under the terms of the CERN-OHL-S v2 (https:/cern.ch/cern-ohl). This documentation is distributed WITHOUT ANY EXPRESS OR IMPLIED WARRANTY, INCLUDING OF MERCHANTABILITY, SATISFACTORY QUALITY AND FITNESS FOR A PARTICULAR PURPOSE. Please see the CERN-OHL-S v2 for applicable conditions.
  As per CERN-OHL-S v2 section 4, should You produce hardware based on these sources, You must maintain the Source Location visible on the silkscreen or top copper for a DI/OT System Board PCB or other product you make using this documentation.
- -------------------------------
- (in symbol CAE430-540_10UF_16V_20%) +
- (in symbol R0402_1K6_1%_0.0625W_100PPM) 1%
- (in symbol R0402_1k_1%_0.0625W_100PPM) 1%
- (in symbol R0402_1K_1%_0.0625W_100PPM) 1%
- (in symbol R0402_6K8_1%_0.0625W_100PPM) 1%
- (in symbol R0402_8K2_1%_0.0625W_100PPM) 1%
- (in symbol R0402_10K_1%_0.0625W_100PPM) 1%
- (in symbol R0402_27K_1%_0.0625W_100PPM) 1%
- (in symbol R0603_1K3_1%_0.1W_100PPM) 1%

### Library data of the parts
B1 B3-B6 = PLATED_HOLE0.6_PAD1.3: as B7 on sheet DIO_MCX_Isolated; Part Number: PLATED_HOLE0.6_PAD1.3; Component Kind: Standard (No BOM); Component Type: Standard (No BOM); Pin Count: 1; Family: Plated Hole; Socket: No; SMD: No; Sense: No; Status: None; ComponentHeight: 0mm; HelpURL: Undefined; Author: CERN DEM MR; CreateDate: 02.03.2016; LatestRevisionDate: 02.03.2016; PackageDescription: Plated Through Hole: Hole Dia.=0.6mm Pad Dia.=1.3mm
C10 C15-C19 = CC0805_10UF_16V_10%_X5R: Non-polarised capacitor; Part Description: SMD Multilayer Chip Ceramic Capacitor; Manufacturer: GENERIC; Manufacturer1 Part Number: C0805C106K4PAC; Voltage: 16V; TC: X5R; Tolerance: ±10%; Part Number: CC0805_10UF_16V_10%_X5R; Component Kind: Standard; Component Type: Standard; Pin Count: 2; Value: 10uF; Status: Preferred; Manufacturer Part Number: CC0805_10UF_16V_10%_X5R; Case: 0805; Mounted: Yes; Socket: No; SMD: Yes; Manufacturer1 Example: KEMET; Manufacturer1 ComponentHeight: 1.4mm; HelpURL: \\cern.ch\dfs\Applications\Altium\Datasheets\CC1206_X5R_KEMET.pdf; Author: CERN DEM JLC; CreateDate: 03.12.2007; LatestRevisionDate: 03.12.2007; Sense: No
C13 = CAE430-540_10UF_16V_20%: Polarised capacitor; Part Description: Aluminum Electrolytic SMT Capacitor; Manufacturer: PANASONIC; Manufacturer Part Number: EEEFK1C100AR; Voltage: 16V; Tolerance: ±20%; Part Number: CAE430-540_10UF_16V_20%; Component Kind: Standard; Component Type: Standard; Pin Count: 2; Value: 10uF; Status: Not Recommended; Case: B; Mounted: Yes; Socket: No; SMD: Yes; Sense: No; ComponentHeight: 5.8mm; HelpURL: \\cern.ch\dfs\Applications\Altium\Datasheets\CAE_PANASONIC_FK.pdf; Author: CERN DEM JLC; CreateDate: 03.12.2007; LatestRevisionDate: 05.11.2014
C14 C121 C123 = CC0805_22UF_16V_10%_X5R: Non-polarised capacitor; Part Description: SMD Multilayer Chip Ceramic Capacitor; Manufacturer: GENERIC; Manufacturer1 Part Number: C2012X5R1C226KT; Voltage: 16V; TC: X5R; Tolerance: ±10%; Part Number: CC0805_22UF_16V_10%_X5R; Component Kind: Standard; Component Type: Standard; Pin Count: 2; Value: 22uF; Status: Preferred; Manufacturer Part Number: CC0805_22UF_16V_10%_X5R; Case: 0805; Mounted: Yes; Socket: No; SMD: Yes; Sense: No; Manufacturer1 Example: TDK; Manufacturer1 ComponentHeight: 1.35mm; HelpURL: \\cern.ch\dfs\Applications\Altium\Datasheets\CC0805_X5R_TDK_C.pdf; Author: CERN DEM JLC; CreateDate: 25.10.2012; LatestRevisionDate: 25.10.2012
C20 C22 = CC0402_100NF_16V_10%_X5R: Non-polarised capacitor; Part Description: SMD Multilayer Chip Ceramic Capacitor; Manufacturer: GENERIC; Manufacturer1 Part Number: GRM155R61C104KA88D; Voltage: 16V; TC: X5R; Tolerance: ±10%; Table: Capacitors SMD; Part Number: CC0402_100NF_16V_10%_X5R; Component Kind: Standard; Component Type: Standard; Pin Count: 2; Value: 100nF; Status: None; Manufacturer Part Number: CC0402_100NF_16V_10%_X5R; Case: 0402; Mounted: Yes; Socket: No; SMD: Yes; Manufacturer1 Example: MURATA; Manufacturer1 ComponentHeight: 0.55mm; HelpURL: \\cern.ch\dfs\Applications\Altium\Datasheets\CC0402_X5R_MURATA_GRM.pdf; Author: CERN DEM JLC; CreateDate: 2013-12-10; LatestRevisionDate: 2013-12-10
C21 = CC0603_1NF_100V_10%_X7R: Non-polarised capacitor; Part Description: SMD Multilayer Chip Ceramic Capacitor; Manufacturer: GENERIC; Manufacturer1 Part Number: C0603C102K1RACTU; Voltage: 100V; TC: X7R; Tolerance: ±10%; Part Number: CC0603_1NF_100V_10%_X7R; Component Kind: Standard; Component Type: Standard; Pin Count: 2; Value: 1nF; Status: Preferred; Manufacturer Part Number: CC0603_1NF_100V_10%_X7R; Case: 0603; Mounted: Yes; Socket: No; SMD: Yes; Sense: No; Manufacturer1 Example: KEMET; Manufacturer1 ComponentHeight: 0.87mm; HelpURL: \\cern.ch\dfs\Applications\Altium\Datasheets\CC0603_X7R_KEMET.pdf; Author: CERN DEM JLC; CreateDate: 12.12.2013; LatestRevisionDate: 12.12.2013
C25 = CC0402_15PF_50V_5%_C0G: Non-polarised capacitor; Part Description: SMD Multilayer Chip Ceramic Capacitor; Manufacturer: GENERIC; Manufacturer1 Part Number: C0402C150J5GACTU; Voltage: 50V; TC: C0G/NP0; Tolerance: ±5%; Part Number: CC0402_15PF_50V_5%_C0G; Component Kind: Standard; Component Type: Standard; Pin Count: 2; Value: 15pF; Status: Preferred; Manufacturer Part Number: CC0402_15PF_50V_5%_C0G; Case: 0402; Mounted: Yes; Socket: No; SMD: Yes; Sense: No; Manufacturer1 Example: KEMET; Manufacturer1 ComponentHeight: 0.55mm; HelpURL: \\cern.ch\dfs\Applications\Altium\Datasheets\CC0805_C0G_KEMET_(Commercial Grade).pdf; Author: CERN DEM JLC; CreateDate: 03.12.2007; LatestRevisionDate: 22.04.2015
C37 C38 = CC0402_1UF_16V_10%_X5R: Non-polarised capacitor; Part Description: SMD Multilayer Chip Ceramic Capacitor; Manufacturer: GENERIC; Manufacturer1 Part Number: C1005X5R1C105KT; Voltage: 16V; TC: X5R; Tolerance: ±10%; Part Number: CC0402_1UF_16V_10%_X5R; Component Kind: Standard; Component Type: Standard; Pin Count: 2; Value: 1uF; Status: Preferred; Manufacturer Part Number: CC0402_1UF_16V_10%_X5R; Case: 0402; Mounted: Yes; Socket: No; SMD: Yes; Sense: No; Manufacturer1 Example: TDK; Manufacturer1 ComponentHeight: 0.55mm; HelpURL: \\cern.ch\dfs\Applications\Altium\Datasheets\CC0402_X5R_TDK_C.pdf; Author: CERN DEM JLC; CreateDate: 25.10.2012; LatestRevisionDate: 25.10.2012
C93 = CC0402_100NF_16V_10%_X5R: Non-polarised capacitor; Part Description: SMD Multilayer Chip Ceramic Capacitor; Manufacturer: GENERIC; Manufacturer1 Part Number: GRM155R61C104KA88D; Voltage: 16V; TC: X5R; Tolerance: ±10%; Part Number: CC0402_100NF_16V_10%_X5R; Component Kind: Standard; Component Type: Standard; Pin Count: 2; Value: 100nF; Status: None; Manufacturer Part Number: CC0402_100NF_16V_10%_X5R; Case: 0402; Mounted: Yes; Socket: No; SMD: Yes; Sense: No; Manufacturer1 Example: MURATA; Manufacturer1 ComponentHeight: 0.55mm; HelpURL: \\cern.ch\dfs\Applications\Altium\Datasheets\CC0402_X5R_MURATA_GRM.pdf; Author: CERN DEM JLC; CreateDate: 10.12.2013; LatestRevisionDate: 10.12.2013
C94 = CC0603_150PF_50V_1%_NP0: Non-polarised capacitor; Part Description: SMD Multilayer Chip Ceramic Capacitor; Manufacturer: GENERIC; Manufacturer1 Part Number: CC0603FRNPO9BN151; Voltage: 50V; TC: C0G/NP0; Tolerance: ±1%; Part Number: CC0603_150PF_50V_1%_NP0; Component Kind: Standard; Component Type: Standard; Pin Count: 2; Value: 150pF; Status: None; Manufacturer Part Number: CC0603_150PF_50V_1%_NP0; Case: 0603; Mounted: Yes; Socket: No; SMD: Yes; Sense: No; Manufacturer1 Example: PHYCOMP; Manufacturer1 ComponentHeight: 0.7mm; HelpURL: \\cern.ch\dfs\Applications\Altium\Datasheets\CC0805_NP0_PHYCOMP_16VTO50V.pdf; Author: CERN DEM MR; CreateDate: 17.02.2016; LatestRevisionDate: 17.02.2016
C95 = CC0603_3.9NF_50V_5%_X7R: Non-polarised capacitor; Part Description: SMD Multilayer Chip Ceramic Capacitor; Manufacturer: GENERIC; Manufacturer1 Part Number: 223858615631; Voltage: 50V; TC: X7R; Tolerance: ±5%; Part Number: CC0603_3.9NF_50V_5%_X7R; Component Kind: Standard; Component Type: Standard; Pin Count: 2; Value: 3.9nF; Status: Preferred; Manufacturer Part Number: CC0603_3.9NF_50V_5%_X7R; Case: 0603; Mounted: Yes; Socket: No; SMD: Yes; Sense: No; Manufacturer1 Example: PHYCOMP; Manufacturer1 ComponentHeight: 0.87mm; HelpURL: \\cern.ch\dfs\Applications\Altium\Datasheets\CC0603_X7R_PHYCOMP.pdf; Author: CERN DEM JLC; CreateDate: 03.12.2007; LatestRevisionDate: 03.12.2007
FTG1 FTG2 FTG17 = FIDUCIAL_TARGET_C100-200: Fiducial Target; Part Description: Round Fiducial Target, Top Layer, 1.0mm, Top Solder 2.0mm, Keepout =2.0mm; Mounted: No; Part Number: FIDUCIAL_TARGET_C100-200; Component Kind: Standard (No BOM); Component Type: Standard (No BOM); Pin Count: 1; Family: Fiducial; Socket: No; SMD: Yes; Sense: No; Status: None; ComponentHeight: 0mm; HelpURL: Undefined; Author: CERN DEM JLC; CreateDate: 09.02.2010; LatestRevisionDate: 04.04.2012; PackageDescription: Round Fiducial Target, Top Layer, 1.0mm, Top Solder 2.0mm, Keepout =2.0mm
FTG18-FTG20 = FIDUCIAL_TARGET_S100-200: Fiducial Target; Part Description: Square Fiducial Target, Top Layer, 1.0mm, Top Solder 2.0mm, Keepout =2.0mm; Mounted: No; Part Number: FIDUCIAL_TARGET_S100-200; Component Kind: Standard (No BOM); Component Type: Standard (No BOM); Pin Count: 1; Family: Fiducial; Socket: No; SMD: Yes; Sense: No; Status: None; ComponentHeight: 0mm; HelpURL: Undefined; Author: CERN DEM JLC; CreateDate: 09.02.2010; LatestRevisionDate: 04.04.2012; PackageDescription: Square Fiducial Target, Top Layer, 1.0mm, Top Solder 2.0mm, Keepout =2.0mm
IC4 = MIC45116-1YMP: 0.8V to 85% PVIN (4.75-19V), 6A Synchronous Step-Down Regulator Module; Manufacturer: MICROCHIP TECHNOLOGY; PressFit: No; Bonding: No; Part Number: MIC45116-1YMP; Component Kind: Standard; Component Type: Standard; Device: MIC45116-1YMP; PackageDescription: MICROCHIP_H3QFN88-52LD-PL-3, 0.50mm Pitch, Square, 52 Pin, 8mm L X 8mm W X 3mm H Body; Part Description: 0.8V to 85% PVIN (4.75-19V), 6A Synchronous Step-Down Regulator Module; Manufacturer Part Number: MIC45116-1YMP; Pin Count: 53; Mounted: Yes; Socket: No; SMD: Yes; Sense: No; ComponentHeight: 3mm; HelpURL: \\cern.ch\dfs\Applications\Altium\Datasheets\MIC45116-1YMP.pdf; Author: CERN DEM JMW; CreateDate: 15.08.2016; LatestRevisionDate: 15.08.2016
IC11 = AP2112K-3.3TRG1: 600mA CMOS Low Dropout Linear Regulator with Enable; Part Description: 3.3V 600mA CMOS Low Dropout Linear Regulator with Enable; Manufacturer: DIODES INCORPORATED; PressFit: No; Bonding: No; Part Number: AP2112K-3.3TRG1; Component Kind: Standard; Component Type: Standard; Device: AP2112K-3.3TRG1; PackageDescription: SOT23, 0.95mm Pitch; 5 Pin, 1.6mm W X 3.0mm L X 1.40mm H body, IPC Medium Density; Manufacturer Part Number: AP2112K-3.3TRG1; Pin Count: 5; Case: SOT25; Mounted: Yes; Socket: No; SMD: Yes; Sense: No; ComponentHeight: 1.4mm; HelpURL: \\cern.ch\dfs\Applications\Altium\Datasheets\AP2112K-3.3TRG1.pdf; Author: CERN DEM MR; CreateDate: 13.12.2017; LatestRevisionDate: 13.12.2017
IC12 = NCP3170ADR2G: Synchronous PWM Switching Converter; Manufacturer: ON SEMICONDUCTOR; PressFit: No; Bonding: No; Part Number: NCP3170ADR2G; Component Kind: Standard; Component Type: Standard; Device: NCP3170ADR2G; PackageDescription: SOIC 8, Pitch 1.27mm - Body 4x5mm, IPC Medium Density; Part Description: Synchronous PWM Switching Converter; Manufacturer Part Number: NCP3170ADR2G; Pin Count: 8; Case: SOIC8; Mounted: Yes; Socket: No; SMD: Yes; Sense: No; ComponentHeight: 1.75mm; Author: CERN DEM MR; HelpURL: \\cern.ch\dfs\Applications\Altium\Datasheets\NCP3170ADR2G.pdf; CreateDate: 30.05.2016; LatestRevisionDate: 30.05.2016
L1 L6 = IND_4.7UH_30%_BOURNS_SRU8043: Power Shielded  4.7uH 30% 4.6A; Part Description: Shielded SMD Power Inductor; Manufacturer: BOURNS; Manufacturer Part Number: SRU8043-4R7Y; Resistance: 0.0174R; Part Number: IND_4.7UH_30%_BOURNS_SRU8043; Component Kind: Standard; Component Type: Standard; Pin Count: 2; Value: 4.7uH; Status: None; Power: 4.6A; Tolerance: ±30%; Mounted: Yes; Socket: No; SMD: Yes; Sense: No; ComponentHeight: 4.6mm; HelpURL: \\cern.ch\dfs\Applications\Altium\Datasheets\IND_BOURNS_SRU8043.pdf; Author: GK; CreateDate: 06.08.2015; LatestRevisionDate: 06.08.2015
LD4 LD7 LD9 = LED_KINGBRIGHT_KPH-1608CGCK: LED Green 1C 2A; Part Description: SMD Green LED, Case 1.6mmX0.8mm(0603), 0.65mm Thickness; PressFit: No; Bonding: No; Part Number: LED_KINGBRIGHT_KPH-1608CGCK; Component Kind: Standard; Component Type: Standard; Color: Green; PackageDescription: SMT Green LED, Case 0603, Body L 1.6 x W 0.8mm H 0.65mm; Manufacturer: KINGBRIGHT; Manufacturer Part Number: KPH-1608CGCK; Pin Count: 2; Mounted: Yes; Socket: No; SMD: Yes; Sense: No; ComponentHeight: 0.65mm; HelpURL: \\cern.ch\dfs\Applications\Altium\Datasheets\LED_KINGBRIGHT_KPH-1608CGCK.pdf; Author: CERN DEM JLC; CreateDate: 03.07.2017; LatestRevisionDate: 03.07.2017
R1 = R0402_6K8_1%_0.0625W_100PPM: Resistor - 1%; Part Description: General Purpose Thick Film Chip Resistor; Manufacturer: GENERIC; Manufacturer1 Part Number: 232270676802L; TC: ±100ppm/°C; PressFit: No; Part Number: R0402_6K8_1%_0.0625W_100PPM; Component Kind: Standard; Component Type: Standard; Pin Count: 2; Value: 6k8; Status: Not Recommended; Power: 0.0625W; Tolerance: ±1%; Manufacturer Part Number: R0402_6K8_1%_0.0625W_100PPM; Case: 0402; Mounted: Yes; Sense: No; Socket: No; SMD: Yes; Manufacturer1 Example: YAGEO PHYCOMP; Manufacturer1 ComponentHeight: 0.4mm; HelpURL: \\cern.ch\dfs\Applications\Altium\Datasheets\R0402_Phycomp_RC0402.pdf; Author: CERN DEM JLC; CreateDate: 03.12.2007; LatestRevisionDate: 17.10.2012
R2 = R0603_1K3_1%_0.1W_100PPM: Resistor - 1%; Part Description: General Purpose Thick Film Chip Resistor; Manufacturer: GENERIC; Manufacturer1 Part Number: NRC06F1301TRF; Power: 0.1W; TC: ±100ppm/°C; PressFit: No; Part Number: R0603_1K3_1%_0.1W_100PPM; Component Kind: Standard; Component Type: Standard; Pin Count: 2; Value: 1k3; Status: Preferred; Tolerance: ±1%; Manufacturer Part Number: R0603_1K3_1%_0.1W_100PPM; Case: 0603; Mounted: Yes; Sense: No; Socket: No; SMD: Yes; Manufacturer1 Example: NIC COMPONENT; Manufacturer1 ComponentHeight: 0.55mm; HelpURL: \\cern.ch\dfs\Applications\Altium\Datasheets\R0603_NIC_NRC.pdf; Author: CERN DEM JLC; CreateDate: 03.12.2007; LatestRevisionDate: 13.03.2008
R6 = R0402_10K_1%_0.0625W_100PPM: as R30 on sheet DIO_MCX_Isolated; Part Number: R0402_10K_1%_0.0625W_100PPM; Component Kind: Standard; Component Type: Standard; Pin Count: 2; Value: 10k; Status: Not recommended; Power: 0.0625W; Tolerance: ±1%; Manufacturer Part Number: R0402_10K_1%_0.0625W_100PPM; Case: 0402; Mounted: Yes; Sense: No; Socket: No; SMD: Yes; Manufacturer1 Example: YAGEO PHYCOMP; Manufacturer1 ComponentHeight: 0.4mm; HelpURL: \\cern.ch\dfs\Applications\Altium\Datasheets\R0402_Phycomp_RC0402.pdf; Author: CERN DEM JLC; CreateDate: 03.12.2007; LatestRevisionDate: 17.10.2012
R8 R10 = R0402_1k_1%_0.0625W_100PPM: Resistor - 1%; Part Description: General Purpose Thick Film Chip Resistor; Manufacturer: GENERIC; Manufacturer1 Part Number: 232270671002L; TC: ±100ppm/°C; PressFit: No; Part Number: R0402_1K_1%_0.0625W_100PPM; Component Kind: Standard; Component Type: Standard; Pin Count: 2; Value: 1k; Status: Not Recommended; Power: 0.0625W; Tolerance: ±1%; Manufacturer Part Number: R0402_1K_1%_0.0625W_100PPM; Case: 0402; Mounted: Yes; Sense: No; Socket: No; SMD: Yes; Manufacturer1 Example: YAGEO PHYCOMP; Manufacturer1 ComponentHeight: 0.4mm; HelpURL: \\cern.ch\dfs\Applications\Altium\Datasheets\R0402_Phycomp_RC0402.pdf; Author: CERN DEM JLC; CreateDate: 03.12.2007; LatestRevisionDate: 17.10.2012
R32 R33 = R0402_10K_1%_0.0625W_100PPM: Resistor - 1%; Part Description: General Purpose Thick Film Chip Resistor; Manufacturer: GENERIC; Manufacturer1 Part Number: 232270671003L; TC: ±100ppm/°C; Table: Resistors SMD; Part Number: R0402_10K_1%_0.0625W_100PPM; Component Kind: Standard; Component Type: Standard; Pin Count: 2; Value: 10k; Status: Not recommended; Power: 0.0625W; Tolerance: ±1%; Manufacturer Part Number: R0402_10K_1%_0.0625W_100PPM; Case: 0402; Mounted: Yes; Socket: No; SMD: Yes; Manufacturer1 Example: YAGEO PHYCOMP; Manufacturer1 ComponentHeight: 0.4mm; HelpURL: \\cern.ch\dfs\Applications\Altium\Datasheets\R0402_Phycomp_RC0402.pdf; Author: CERN DEM JLC; CreateDate: 2007-12-03; LatestRevisionDate: 2012-10-17
R36 R37 = R0402_1K6_1%_0.0625W_100PPM: Resistor - 1%; Part Description: General Purpose Thick Film Chip Resistor; Manufacturer: GENERIC; Manufacturer1 Part Number: 232270671602L; TC: ±100ppm/°C; PressFit: No; Part Number: R0402_1K6_1%_0.0625W_100PPM; Component Kind: Standard; Component Type: Standard; Pin Count: 2; Value: 1k6; Status: Not Recommended; Power: 0.0625W; Tolerance: ±1%; Manufacturer Part Number: R0402_1K6_1%_0.0625W_100PPM; Case: 0402; Mounted: Yes; Sense: No; Socket: No; SMD: Yes; Manufacturer1 Example: YAGEO PHYCOMP; Manufacturer1 ComponentHeight: 0.4mm; HelpURL: \\cern.ch\dfs\Applications\Altium\Datasheets\R0402_Phycomp_RC0402.pdf; Author: CERN DEM JLC; CreateDate: 03.12.2007; LatestRevisionDate: 17.10.2012
R68 = R0402_1K_1%_0.0625W_100PPM: Resistor - 1%; Part Description: General Purpose Thick Film Chip Resistor; Manufacturer: GENERIC; Manufacturer1 Part Number: 232270671002L; TC: ±100ppm/°C; PressFit: No; Part Number: R0402_1K_1%_0.0625W_100PPM; Component Kind: Standard; Component Type: Standard; Pin Count: 2; Value: 1k; Status: Not Recommended; Power: 0.0625W; Tolerance: ±1%; Manufacturer Part Number: R0402_1K_1%_0.0625W_100PPM; Case: 0402; Mounted: Yes; Sense: No; Socket: No; SMD: Yes; Manufacturer1 Example: YAGEO PHYCOMP; Manufacturer1 ComponentHeight: 0.4mm; HelpURL: \\cern.ch\dfs\Applications\Altium\Datasheets\R0402_Phycomp_RC0402.pdf; Author: CERN DEM JLC; CreateDate: 03.12.2007; LatestRevisionDate: 17.10.2012
R101 = R0402_27K_1%_0.0625W_100PPM: Resistor - 1%; Part Description: General Purpose Thick Film Chip Resistor; Manufacturer: GENERIC; Manufacturer1 Part Number: 232270672703L; TC: ±100ppm/°C; PressFit: No; Part Number: R0402_27K_1%_0.0625W_100PPM; Component Kind: Standard; Component Type: Standard; Pin Count: 2; Value: 27k; Status: Not Recommended; Power: 0.0625W; Tolerance: ±1%; Manufacturer Part Number: R0402_27K_1%_0.0625W_100PPM; Case: 0402; Mounted: Yes; Sense: No; Socket: No; SMD: Yes; Manufacturer1 Example: YAGEO PHYCOMP; Manufacturer1 ComponentHeight: 0.4mm; HelpURL: \\cern.ch\dfs\Applications\Altium\Datasheets\R0402_Phycomp_RC0402.pdf; Author: CERN DEM JLC; CreateDate: 03/12/2007; LatestRevisionDate: 17/10/2012
R103 = R0402_8K2_1%_0.0625W_100PPM: Resistor - 1%; Part Description: General Purpose Thick Film Chip Resistor; Manufacturer: GENERIC; Manufacturer1 Part Number: 232270678202L; TC: ±100ppm/°C; PressFit: No; Part Number: R0402_8K2_1%_0.0625W_100PPM; Component Kind: Standard; Component Type: Standard; Pin Count: 2; Value: 8k2; Status: Not Recommended; Power: 0.0625W; Tolerance: ±1%; Manufacturer Part Number: R0402_8K2_1%_0.0625W_100PPM; Case: 0402; Mounted: Yes; Sense: No; Socket: No; SMD: Yes; Manufacturer1 Example: YAGEO PHYCOMP; Manufacturer1 ComponentHeight: 0.4mm; HelpURL: \\cern.ch\dfs\Applications\Altium\Datasheets\R0402_Phycomp_RC0402.pdf; Author: CERN DEM JLC; CreateDate: 03.12.2007; LatestRevisionDate: 17.10.2012
R104 R105 = R0402_10K_1%_0.0625W_100PPM: Resistor - 1%; Part Description: General Purpose Thick Film Chip Resistor; Manufacturer: GENERIC; Manufacturer1 Part Number: 232270671003L; TC: ±100ppm/°C; PressFit: No; Part Number: R0402_10K_1%_0.0625W_100PPM; Component Kind: Standard; Component Type: Standard; Pin Count: 2; Value: 10k; Status: Not Recommended; Power: 0.0625W; Tolerance: ±1%; Manufacturer Part Number: R0402_10K_1%_0.0625W_100PPM; Case: 0402; Mounted: Yes; Sense: No; Socket: No; SMD: Yes; Manufacturer1 Example: YAGEO PHYCOMP; Manufacturer1 ComponentHeight: 0.4mm; HelpURL: \\cern.ch\dfs\Applications\Altium\Datasheets\R0402_Phycomp_RC0402.pdf; Author: CERN DEM JLC; CreateDate: 03.12.2007; LatestRevisionDate: 17.10.2012
TP1 TP2 = SMD_PAD_1.27X1.27MM: Part Description: 1.27mm x 1.27mm PCB Copper Area (SMD Test Point); Mounted: No; Part Number: SMD_PAD_1.27X1.27MM; Component Kind: Standard (No BOM); Component Type: Standard (No BOM); Pin Count: 1; Family: Test Point; Socket: No; SMD: No; Sense: No; Status: None; ComponentHeight: 0mm; HelpURL: Undefined; Author: CERN DEM JLC; CreateDate: 12.01.2008; LatestRevisionDate: 12.01.2008; PackageDescription: 1.27mm x 1.27mm PCB Copper Area (SMD Test Point)